# EAGLE schematic MultiWii Board (EAGLE 6.4)
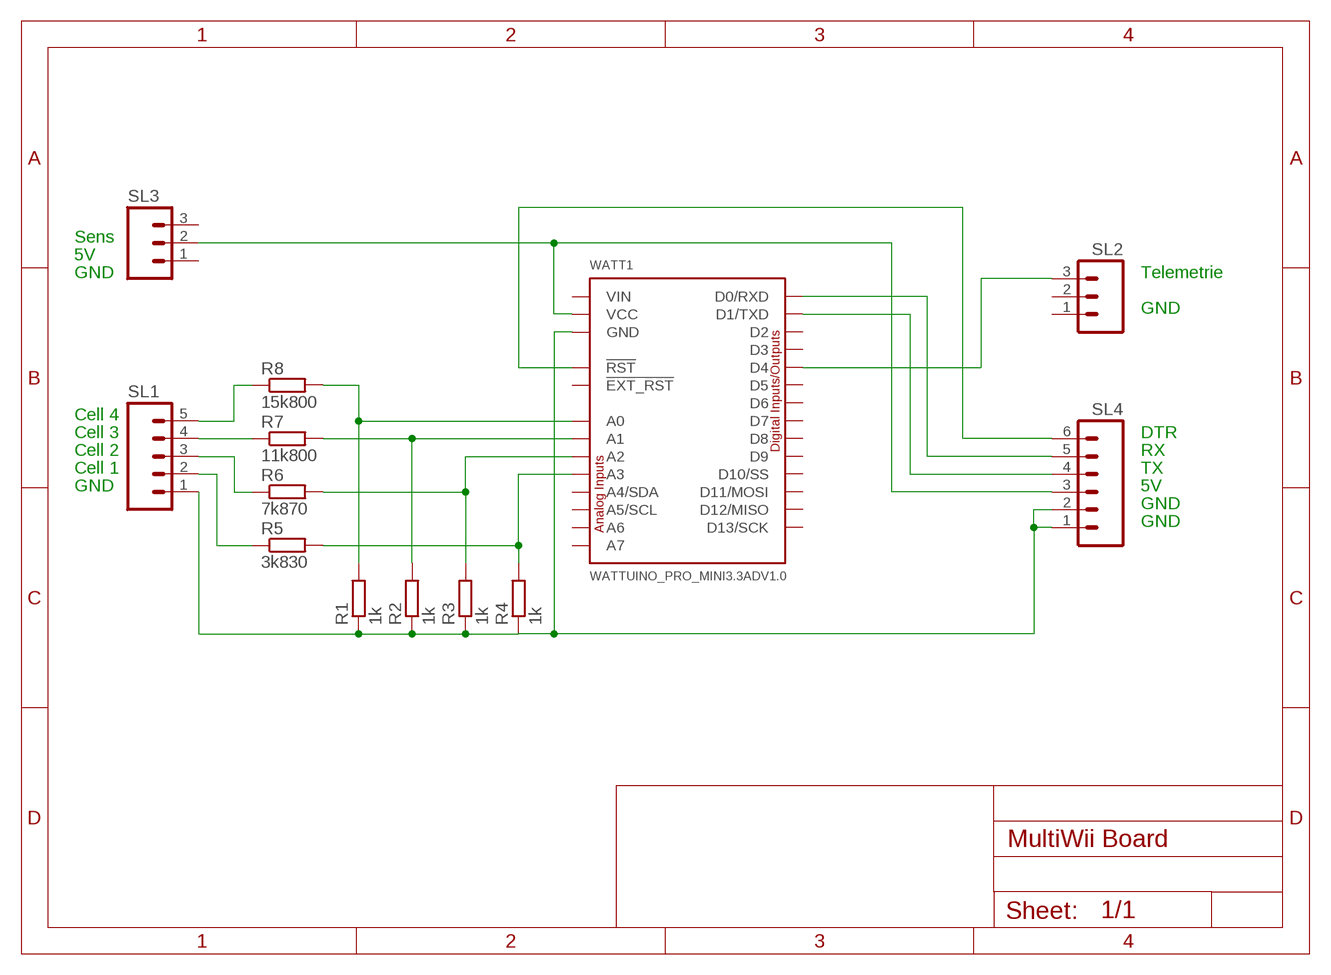
[diagram p0: schematic, sheet 1]

## Parts
R1  1k  R-EU_0207/7  [0207/7]
R2  1k  R-EU_0207/7  [0207/7]
R3  1k  R-EU_0207/7  [0207/7]
R4  1k  R-EU_0207/7  [0207/7]
R5  3k830  R-EU_0207/7  [0207/7]
R6  7k870  R-EU_0207/7  [0207/7]
R7  11k800  R-EU_0207/7  [0207/7]
R8  15k800  R-EU_0207/7  [0207/7]
SL1  M05  [05P]
SL2  M03  [03P]
SL3  M03  [03P]
SL4  M06  [06P]
WATT1  WATTUINO_PRO_MINI3.3ADV1.0  [WATTUINO_PRO_MINI]

## Nets
N$1: R1.1 R2.1 R3.1 R4.1 SL1.1 SL4.1 SL4.2 WATT1.GND@1(GND)
N$2: SL4.4 WATT1.TXD@1(D1/TXD)
N$3: R5.1 SL1.2
N$4: R6.1 SL1.3
N$5: R7.1 SL1.4
N$6: R8.1 SL1.5
N$7: R1.2 R8.2 WATT1.A0
N$8: R2.2 R7.2 WATT1.A1
N$9: R3.2 R6.2 WATT1.A2
N$10: R4.2 R5.2 WATT1.A3
N$11: SL4.6 WATT1.RST@1(!RST)
N$12: SL4.5 WATT1.RXD@1(D0/RXD)
N$13: SL3.2 SL4.3 WATT1.VCC@1(VCC)
N$14: SL2.3 WATT1.4(D4)
Unconnected: SL2.1 SL2.2 SL3.1 SL3.3 WATT1.2(D2) WATT1.3(D3) WATT1.5(D5) WATT1.6(D6) WATT1.7(D7) WATT1.8(D8) WATT1.9(D9) WATT1.10(D10/SS) WATT1.11(D11/MOSI) WATT1.12(D12/MISO) WATT1.13(D13/SCK) WATT1.A4(A4/SDA) WATT1.A5(A5/SCL) WATT1.A6 WATT1.A7 WATT1.EXT_RST(!EXT_RST)

## Notes on the sheet
- Sens
- 5V
- GND | Telemetrie
- GND
- Cell 4
- Cell 3 | DTR
- Cell 2 | RX
- Cell 1 | TX
- GND | 5V
- GND
- GND

## Power pins joined to a net without a drawn wire
VIN: WATT1.VIN

## Library data of the parts
R1-R8 = resistor:R-EU_: RESISTOR, European symbol
SL1 = con-amp-quick:M05: AMP QUICK CONNECTOR; OC_FARNELL: unknown; OC_NEWARK: unknown
SL2 SL3 = con-amp-quick:M03: AMP QUICK CONNECTOR; OC_FARNELL: unknown; OC_NEWARK: unknown
SL4 = con-amp-quick:M06: AMP QUICK CONNECTOR; OC_FARNELL: unknown; OC_NEWARK: unknown
WATT1 = wattuino:WATTUINO_PRO_MINI: Wattuino Pro Mini Arduino compatible module, available as 5V / 16MHz <http://www.watterott.com/en/Wattuino-pro-mini-5V-16MHz> and 3.3V / 8MHz <http://www.watterott.com/en/Wattuino-pro-mini-3V3-8MHz> versions from Watterott electronic <http://www.watterott.com>. Source: https://github.com/watterott/wattuino Features Atmel AVR ATmega328P @ 16MHz or 8MHz (external resonator) Compatible with Arduino Pro Mini LC filter on AVCC of the AVR microcontroller All pins of the AVR are available (also ADC6, ADC7) USB connection off board 5V or 3V3 voltage regulator Over current protected Note to the symbol: I declared the EXT_RST pin as I/O even it is an input only. Usually this pin is unused. Declared as input only, the ERC check would complain an unconnected input in this common case. This work is licensed under a Creative Commons Attribution-ShareAlike 3.0 Unported License <http://creativecommons.org/licenses/by-sa/3.0/>. Created by Jens Bachmann; CLOCK: 8 MHz; VCC: 3.3 V